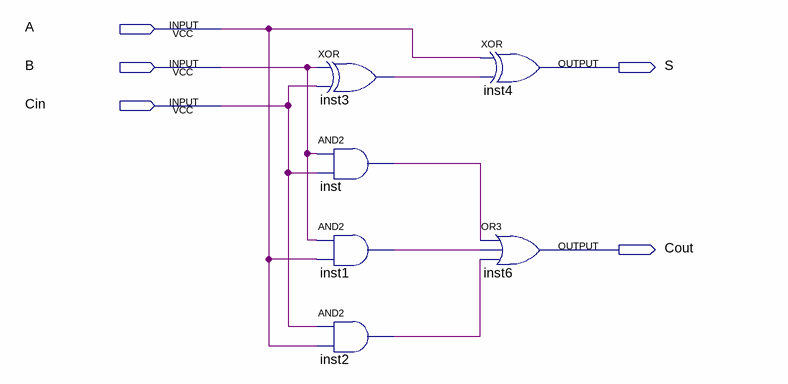
[diagram p0: schematic sheet]
// Quartus schematic Block1.bdf as structural Verilog: 6 symbols, 5 pins
module Block1 (
  input  A,
  input  B,
  input  Cin,
  output S,
  output Cout
);

  wire inst1_out, inst2_out, inst3_out, inst_out;

  xor inst3 (inst3_out, B, Cin);
  and inst (inst_out, B, Cin);
  and inst1 (inst1_out, B, A);
  and inst2 (inst2_out, Cin, A);
  xor inst4 (S, A, inst3_out);
  or inst6 (Cout, inst_out, inst1_out, inst2_out);
endmodule
